# EAGLE schematic SHT4x_2 (EAGLE 9.6.2)
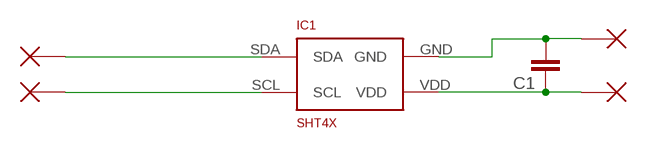
[diagram p0: schematic, sheet 1]

## Parts
C1  SMD-C-1206  [C1206]
IC1  SHT4X  [SHT4X]
P1  PIN  [PIN]
P2  PIN  [PIN]
P3  PIN  [PIN]
P4  PIN  [PIN]

## Nets
GND: C1.2 IC1.GND P3.P$1
N$2: IC1.SCL P2.P$1
SDA: IC1.SDA P1.P$1
VDD: C1.1 IC1.VDD P4.P$1

## Library data of the parts
C1 = Standardbauteile:SMD-C-1206
IC1 = Microcontroller-Periphery:SHT4X
P1-P4 = Mechanik:PIN